# Altium schematic sheet REO_ECG.SchDoc
size 420 x 297 mm; SheetNumber: 1; SheetTotal: 6
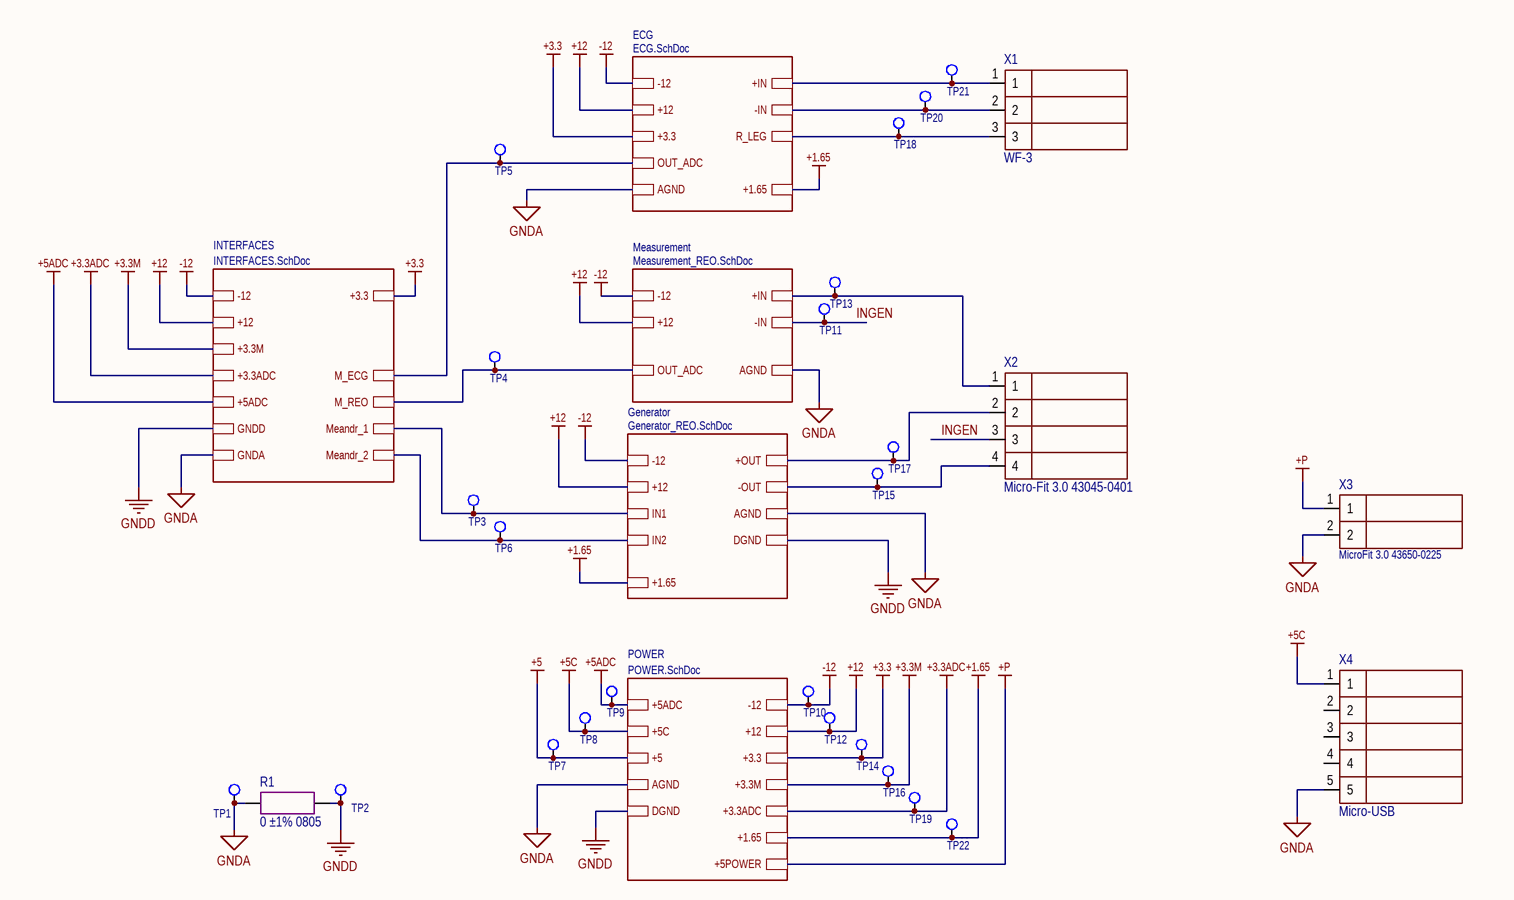
[diagram p0: REO_ECG.SchDoc]

## Parts
R1  0 ±1% 0805  [RES: SMD 0805 MD IPC 782]
TP1  Test point  [Test Point]  (value not drawn)  (net tie)
TP2  Test point  [Test Point]  (value not drawn)  (net tie)
TP3  Test point  [Test Point]  (value not drawn)  (net tie)
TP4  Test point  [Test Point]  (value not drawn)  (net tie)
TP5  Test point  [Test Point]  (value not drawn)  (net tie)
TP6  Test point  [Test Point]  (value not drawn)  (net tie)
TP7  Test point  [Test Point]  (value not drawn)  (net tie)
TP8  Test point  [Test Point]  (value not drawn)  (net tie)
TP9  Test point  [Test Point]  (value not drawn)  (net tie)
TP10  Test point  [Test Point]  (value not drawn)  (net tie)
TP11  Test point  [Test Point]  (value not drawn)  (net tie)
TP12  Test point  [Test Point]  (value not drawn)  (net tie)
TP13  Test point  [Test Point]  (value not drawn)  (net tie)
TP14  Test point  [Test Point]  (value not drawn)  (net tie)
TP15  Test point  [Test Point]  (value not drawn)  (net tie)
TP16  Test point  [Test Point]  (value not drawn)  (net tie)
TP17  Test point  [Test Point]  (value not drawn)  (net tie)
TP18  Test point  [Test Point]  (value not drawn)  (net tie)
TP19  Test point  [Test Point]  (value not drawn)  (net tie)
TP20  Test point  [Test Point]  (value not drawn)  (net tie)
TP21  Test point  [Test Point]  (value not drawn)  (net tie)
TP22  Test point  [Test Point]  (value not drawn)  (net tie)
X1  WF-3  [CON: 3pin wf-3]
X2  Micro-Fit 3.0 43045-0401  [CON: 4pin Molex MicroFit 3.0 43045-0401]
X3  MicroFit 3.0 43650-0225  [CON: 2pin Molex MicroFit 3.0 43650-0225]
X4  Micro-USB  [CON: 5pin USB Micro]

## Sub-sheets
ECG = ECG.SchDoc: AGND, -12, +12, +3.3, +IN, -IN, OUT_ADC, R_LEG, +1.65
Generator = Generator_REO.SchDoc: AGND, -OUT, IN1, +OUT, -12, +12, IN2, DGND, +1.65
INTERFACES = INTERFACES.SchDoc: Meandr_1, M_ECG, GNDD, GNDA, M_REO, Meandr_2, +5ADC, +3.3ADC, +3.3M, +12, -12, +3.3
Measurement = Measurement_REO.SchDoc: AGND, -12, +12, +IN, -IN, OUT_ADC
POWER = POWER.SchDoc: AGND, -12, +12, +3.3, +5ADC, +3.3M, +5C, +5, DGND, +3.3ADC, +1.65, +5POWER

## Nets
+1.65: TP22.1 ; sheet Generator/+1.65, sheet POWER/+1.65, sheet ECG/+1.65
+3.3: TP14.1 ; sheet POWER/+3.3, sheet ECG/+3.3, sheet INTERFACES/+3.3
+3.3ADC: TP19.1 ; sheet POWER/+3.3ADC, sheet INTERFACES/+3.3ADC
+3.3M: TP16.1 ; sheet POWER/+3.3M, sheet INTERFACES/+3.3M
+5: TP7.1 ; sheet POWER/+5
+5ADC: TP9.1 ; sheet POWER/+5ADC, sheet INTERFACES/+5ADC
+5C: TP8.1 X4.1 ; sheet POWER/+5C
+12: TP12.1 ; sheet Generator/+12, sheet Measurement/+12, sheet POWER/+12, sheet ECG/+12, sheet INTERFACES/+12
+P: X3.1 ; sheet POWER/+5POWER
-12: TP10.1 ; sheet Generator/-12, sheet Measurement/-12, sheet POWER/-12, sheet ECG/-12, sheet INTERFACES/-12
GNDA: R1.1 TP1.1 X3.2 X4.5 ; sheet Generator/AGND, sheet Measurement/AGND, sheet POWER/AGND, sheet ECG/AGND, sheet INTERFACES/GNDA
GNDD: R1.2 TP2.1 ; sheet Generator/DGND, sheet POWER/DGND, sheet INTERFACES/GNDD
INGEN: TP11.1 X2.3 ; sheet Measurement/-IN
NetTP3_1: TP3.1 ; sheet Generator/IN1, sheet INTERFACES/Meandr_1
NetTP4_1: TP4.1 ; sheet Measurement/OUT_ADC, sheet INTERFACES/M_REO
NetTP5_1: TP5.1 ; sheet ECG/OUT_ADC, sheet INTERFACES/M_ECG
NetTP6_1: TP6.1 ; sheet Generator/IN2, sheet INTERFACES/Meandr_2
NetTP13_1: TP13.1 X2.1 ; sheet Measurement/+IN
NetTP15_1: TP15.1 X2.4 ; sheet Generator/-OUT
NetTP17_1: TP17.1 X2.2 ; sheet Generator/+OUT
NetTP18_1: TP18.1 X1.3 ; sheet ECG/R_LEG
NetTP20_1: TP20.1 X1.2 ; sheet ECG/-IN
NetTP21_1: TP21.1 X1.1 ; sheet ECG/+IN

Not connected (* = marked no-connect by the designer): X4 2 3 4

## Notes on the sheet
- Перв. примен.
- 3707.00000000 ЭИТ-1
- Справ. №
- Подп. и дата
- Инв. № дубл.
- Взам. инв. №
- Разраб.
- Изм.
- Лист
- № докум.
- Подп.
- Дата
- Лит.
- Масса
- Масштаб
- Пров.
- Т.контр.
- Листов
- Инв. № подл.
- Утв.
- Н.контр.
- 2.106-A3
- Копировал
- Формат А3

## Library data of the parts
R1 = 0 ±1% 0805: Code: 6094342239; Name: Резистор 0R ±1% 0805
X1 = 3 pin WF-3: Code: 6313932013; Name: Вилка WF-3
X2 = 4 pin MicroFit DR R Molex: Code: *; Name: *
X3 = 2 pin MicroFit SR Molex: Name: Вилка Micro-Fit 3.0 43650-0225, Molex; Code: 6319211711
X4 = 5 pin USB Micro SMD: Code: 6319209171; Name: Розетка 10118194-0001LF, Amphenol